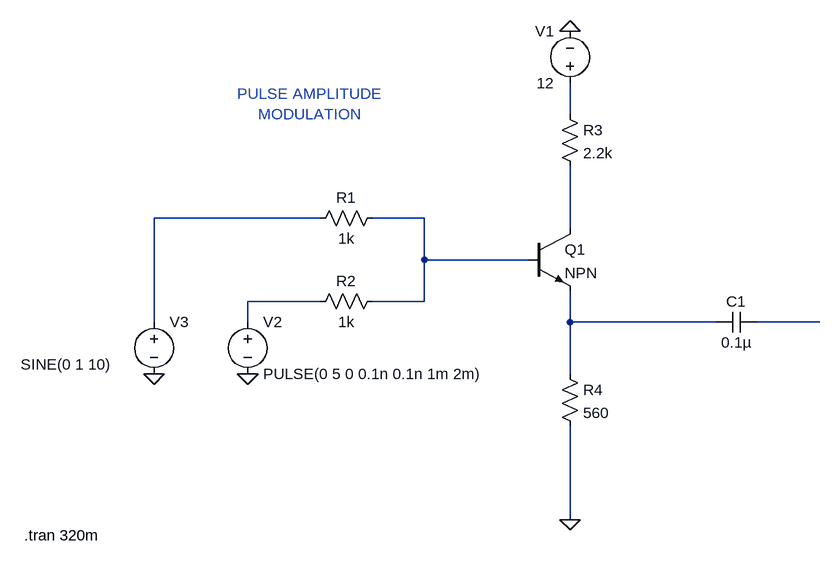
[diagram p0: schematic Pulse Amplitude Modulation.asc]
Pulse Amplitude Modulation.asc, the LTspice schematic file:
Version 4
SHEET 1 900 680
WIRE 304 -176 304 -224
WIRE -80 -16 -336 -16
WIRE 80 -16 0 -16
WIRE 304 0 304 -96
WIRE 80 48 80 -16
WIRE 240 48 80 48
WIRE -80 112 -192 112
WIRE 80 112 80 48
WIRE 80 112 0 112
WIRE -336 144 -336 -16
WIRE -192 144 -192 112
WIRE 304 144 304 96
WIRE 528 144 304 144
WIRE 688 144 592 144
WIRE 304 224 304 144
WIRE 304 448 304 304
FLAG 304 448 0
FLAG -192 224 0
FLAG -336 224 0
FLAG 304 -304 0
SYMBOL npn 240 0 R0
SYMATTR InstName Q1
SYMBOL res 16 -32 R90
WINDOW 0 0 56 VBottom 2
WINDOW 3 32 56 VTop 2
SYMATTR InstName R1
SYMATTR Value 1k
SYMBOL res 16 96 R90
WINDOW 0 0 56 VBottom 2
WINDOW 3 32 56 VTop 2
SYMATTR InstName R2
SYMATTR Value 1k
SYMBOL res 288 -192 R0
SYMATTR InstName R3
SYMATTR Value 2.2k
SYMBOL res 288 208 R0
SYMATTR InstName R4
SYMATTR Value 560
SYMBOL cap 592 128 R90
WINDOW 0 0 32 VBottom 2
WINDOW 3 32 32 VTop 2
SYMATTR InstName C1
SYMATTR Value 0.1µ
SYMBOL voltage 304 -208 R180
WINDOW 0 24 96 Left 2
WINDOW 3 24 16 Left 2
WINDOW 123 0 0 Left 0
WINDOW 39 0 0 Left 0
SYMATTR InstName V1
SYMATTR Value 12
SYMBOL voltage -192 128 R0
WINDOW 123 0 0 Left 0
WINDOW 39 0 0 Left 0
SYMATTR InstName V2
SYMATTR Value PULSE(0 5 0 0.1n 0.1n 1m 2m)
SYMBOL voltage -336 128 R0
WINDOW 3 -205 81 Left 2
WINDOW 123 0 0 Left 0
WINDOW 39 0 0 Left 0
SYMATTR InstName V3
SYMATTR Value SINE(0 1 10)
TEXT -536 472 Left 2 !.tran 320m
TEXT -208 -208 Left 2 ;PULSE AMPLITUDE
TEXT -176 -176 Left 2 ;MODULATION

The netlist it stands for:
* Pulse Amplitude Modulation.asc
Q1 N004 N003 N006 0 NPN
R1 N003 N002 1k
R2 N003 N005 1k
R3 N001 N004 2.2k
R4 N006 0 560
C1 N007 N006 0.1µ
V1 N001 0 12
V2 N005 0 PULSE(0 5 0 0.1n 0.1n 1m 2m)
V3 N002 0 SINE(0 1 10)
.model NPN NPN
.model PNP PNP
.lib standard.bjt
.tran 320m
* PULSE AMPLITUDE
* MODULATION
.backanno
.end